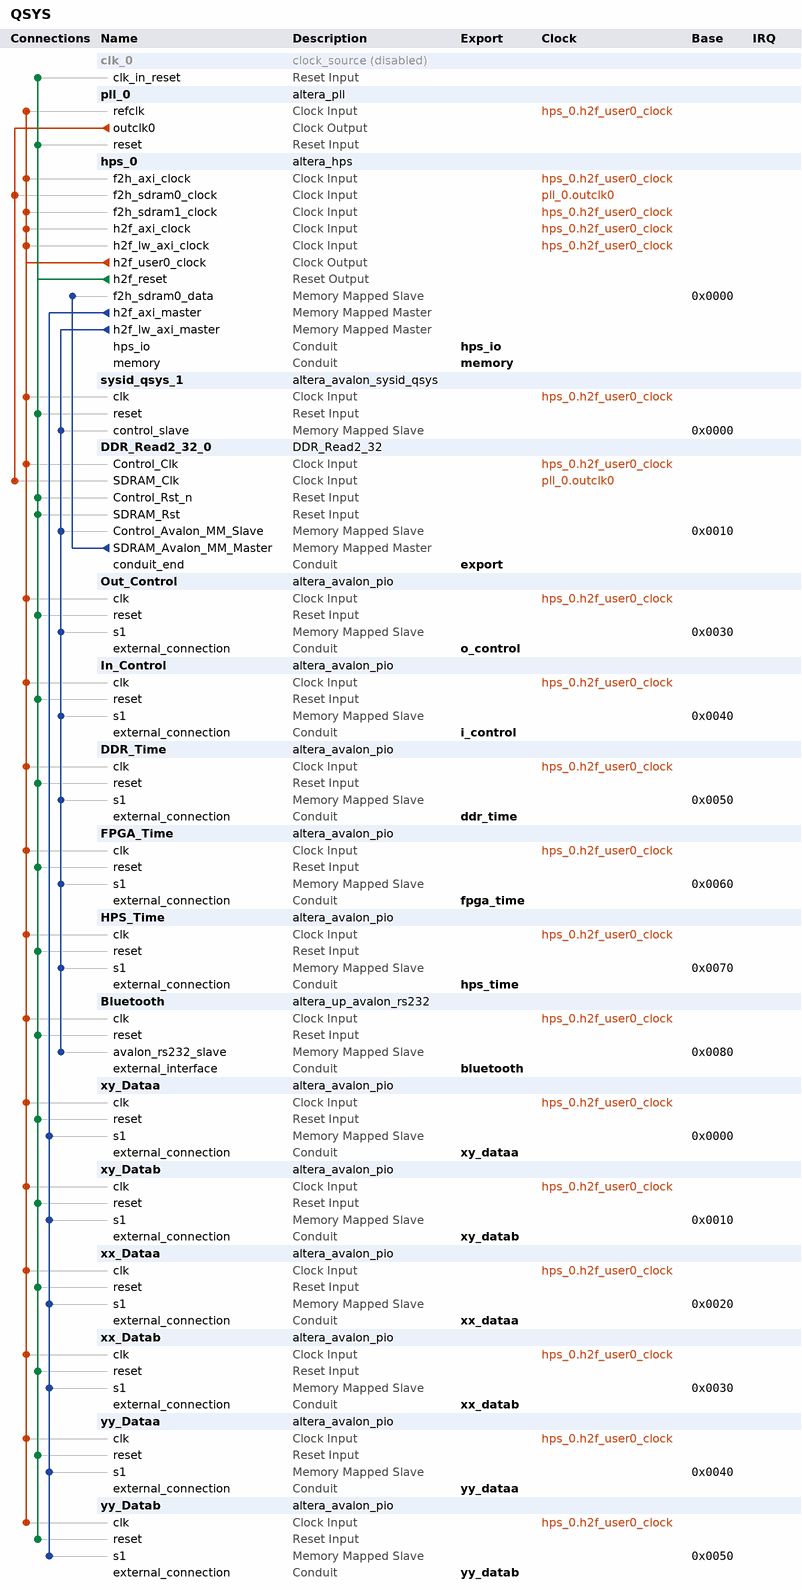
[diagram p0: system contents]
# Platform Designer (Qsys) system QSYS, Cyclone V 5CSXFC6D6F31C6
# Parameters at their usual value, and those the tool derives, are not listed.
package require -exact qsys 20.1
create_system QSYS
set_project_property DEVICE_FAMILY {Cyclone V}
set_project_property DEVICE 5CSXFC6D6F31C6

add_instance clk_0 clock_source 20.1
set_instance_property clk_0 ENABLED false
set_instance_parameter_value clk_0 clockFrequency 100000000

add_instance pll_0 altera_pll 20.1
set_instance_parameter_value pll_0 gui_device_speed_grade 1
set_instance_parameter_value pll_0 gui_number_of_clocks 1
set_instance_parameter_value pll_0 gui_operation_mode direct
set_instance_parameter_value pll_0 gui_output_clock_frequency0 230.0
set_instance_parameter_value pll_0 gui_pll_mode {Integer-N PLL}
set_instance_parameter_value pll_0 gui_reference_clock_frequency 100.0
set_instance_parameter_value pll_0 gui_use_locked true

add_instance hps_0 altera_hps 20.1
set_instance_parameter_value hps_0 CAN0_Mode CAN
set_instance_parameter_value hps_0 CAN0_PinMuxing {HPS I/O Set 1}
set_instance_parameter_value hps_0 EMAC1_Mode RGMII
set_instance_parameter_value hps_0 EMAC1_PinMuxing {HPS I/O Set 0}
set_instance_parameter_value hps_0 F2SCLK_COLDRST_Enable false
set_instance_parameter_value hps_0 F2SCLK_DBGRST_Enable false
set_instance_parameter_value hps_0 F2SCLK_WARMRST_Enable false
set_instance_parameter_value hps_0 F2SDRAM_Type {Avalon-MM Read-Only,Avalon-MM Read-Only}
set_instance_parameter_value hps_0 F2SDRAM_Width 32,32
set_instance_parameter_value hps_0 F2SINTERRUPT_Enable false
set_instance_parameter_value hps_0 F2S_Width 3
set_instance_parameter_value hps_0 FPGA_PERIPHERAL_OUTPUT_CLOCK_FREQ_EMAC0_GTX_CLK 125
set_instance_parameter_value hps_0 FPGA_PERIPHERAL_OUTPUT_CLOCK_FREQ_EMAC0_MD_CLK 2.5
set_instance_parameter_value hps_0 FPGA_PERIPHERAL_OUTPUT_CLOCK_FREQ_EMAC1_GTX_CLK 125
set_instance_parameter_value hps_0 FPGA_PERIPHERAL_OUTPUT_CLOCK_FREQ_EMAC1_MD_CLK 2.5
set_instance_parameter_value hps_0 HPS_PROTOCOL DDR3
set_instance_parameter_value hps_0 I2C0_Mode I2C
set_instance_parameter_value hps_0 I2C0_PinMuxing {HPS I/O Set 1}
set_instance_parameter_value hps_0 I2C1_Mode N/A
set_instance_parameter_value hps_0 I2C1_PinMuxing Unused
set_instance_parameter_value hps_0 LWH2F_Enable true
set_instance_parameter_value hps_0 MEM_BANKADDR_WIDTH 3
set_instance_parameter_value hps_0 MEM_CLK_FREQ 400.0
set_instance_parameter_value hps_0 MEM_COL_ADDR_WIDTH 10
set_instance_parameter_value hps_0 MEM_DQ_WIDTH 32
set_instance_parameter_value hps_0 MEM_DRV_STR RZQ/6
set_instance_parameter_value hps_0 MEM_ROW_ADDR_WIDTH 15
set_instance_parameter_value hps_0 MEM_RTT_NOM RZQ/6
set_instance_parameter_value hps_0 MEM_RTT_WR {Dynamic ODT off}
set_instance_parameter_value hps_0 MEM_TCL 11
set_instance_parameter_value hps_0 MEM_TFAW_NS 45.0
set_instance_parameter_value hps_0 MEM_TRAS_NS 35.0
set_instance_parameter_value hps_0 MEM_TRCD_NS 13.75
set_instance_parameter_value hps_0 MEM_TRFC_NS 260.0
set_instance_parameter_value hps_0 MEM_TRP_NS 13.75
set_instance_parameter_value hps_0 MEM_VENDOR Micron
set_instance_parameter_value hps_0 MEM_WTCL 7
set_instance_parameter_value hps_0 QSPI_Mode N/A
set_instance_parameter_value hps_0 QSPI_PinMuxing Unused
set_instance_parameter_value hps_0 REF_CLK_FREQ 25.0
set_instance_parameter_value hps_0 S2FCLK_USER0CLK_Enable true
set_instance_parameter_value hps_0 S2FCLK_USER2CLK 3
set_instance_parameter_value hps_0 S2F_Width 3
set_instance_parameter_value hps_0 SDIO_Mode {4-bit Data}
set_instance_parameter_value hps_0 SDIO_PinMuxing {HPS I/O Set 0}
set_instance_parameter_value hps_0 SPIM1_Mode N/A
set_instance_parameter_value hps_0 SPIM1_PinMuxing Unused
set_instance_parameter_value hps_0 STM_Enable false
set_instance_parameter_value hps_0 TIMING_BOARD_AC_SKEW 0.02
set_instance_parameter_value hps_0 TIMING_BOARD_AC_TO_CK_SKEW 0.01
set_instance_parameter_value hps_0 TIMING_BOARD_DQ_TO_DQS_SKEW 0.05
set_instance_parameter_value hps_0 TIMING_BOARD_MAX_CK_DELAY 0.03
set_instance_parameter_value hps_0 TIMING_BOARD_MAX_DQS_DELAY 0.02
set_instance_parameter_value hps_0 TIMING_BOARD_SKEW_BETWEEN_DQS 0.06
set_instance_parameter_value hps_0 TIMING_BOARD_SKEW_CKDQS_DIMM_MAX 0.12
set_instance_parameter_value hps_0 TIMING_BOARD_SKEW_CKDQS_DIMM_MIN 0.06
set_instance_parameter_value hps_0 TIMING_BOARD_SKEW_WITHIN_DQS 0.01
set_instance_parameter_value hps_0 TIMING_TDH 65
set_instance_parameter_value hps_0 TIMING_TDQSCK 255
set_instance_parameter_value hps_0 TIMING_TDQSQ 125
set_instance_parameter_value hps_0 TIMING_TDS 30
set_instance_parameter_value hps_0 TIMING_TIH 140
set_instance_parameter_value hps_0 TIMING_TIS 190
set_instance_parameter_value hps_0 TIMING_TQSH 0.4
set_instance_parameter_value hps_0 UART0_Mode {No Flow Control}
set_instance_parameter_value hps_0 UART0_PinMuxing {HPS I/O Set 0}
set_instance_parameter_value hps_0 USB1_Mode SDR
set_instance_parameter_value hps_0 USB1_PinMuxing {HPS I/O Set 0}
set_instance_parameter_value hps_0 desired_cfg_clk_mhz 100.0
set_instance_parameter_value hps_0 desired_qspi_clk_mhz 400.0

add_instance sysid_qsys_1 altera_avalon_sysid_qsys 20.1
set_instance_parameter_value sysid_qsys_1 id 305419896

add_instance DDR_Read2_32_0 DDR_Read2_32 1.0
set_instance_parameter_value DDR_Read2_32_0 MASTER_ADDRESSWIDTH 32
set_instance_parameter_value DDR_Read2_32_0 MASTER_DATAWIDTH 32
set_instance_parameter_value DDR_Read2_32_0 NUMREGS 3
set_instance_parameter_value DDR_Read2_32_0 REGWIDTH 32
set_instance_parameter_value DDR_Read2_32_0 SLAVE_ADDRESSWIDTH 2
set_instance_parameter_value DDR_Read2_32_0 SLAVE_DATAWIDTH 32

add_instance Out_Control altera_avalon_pio 20.1
set_instance_parameter_value Out_Control direction Output
set_instance_parameter_value Out_Control width 32

add_instance In_Control altera_avalon_pio 20.1
set_instance_parameter_value In_Control direction Input
set_instance_parameter_value In_Control width 32

add_instance DDR_Time altera_avalon_pio 20.1
set_instance_parameter_value DDR_Time direction Input
set_instance_parameter_value DDR_Time width 26

add_instance FPGA_Time altera_avalon_pio 20.1
set_instance_parameter_value FPGA_Time direction Input
set_instance_parameter_value FPGA_Time width 26

add_instance HPS_Time altera_avalon_pio 20.1
set_instance_parameter_value HPS_Time direction Input
set_instance_parameter_value HPS_Time width 26

add_instance Bluetooth altera_up_avalon_rs232 17.1
set_instance_parameter_value Bluetooth baud 9600
set_instance_parameter_value Bluetooth parity None

add_instance xy_Dataa altera_avalon_pio 20.1
set_instance_parameter_value xy_Dataa direction Input
set_instance_parameter_value xy_Dataa width 32

add_instance xy_Datab altera_avalon_pio 20.1
set_instance_parameter_value xy_Datab direction Input
set_instance_parameter_value xy_Datab width 32

add_instance xx_Dataa altera_avalon_pio 20.1
set_instance_parameter_value xx_Dataa direction Input
set_instance_parameter_value xx_Dataa width 32

add_instance xx_Datab altera_avalon_pio 20.1
set_instance_parameter_value xx_Datab direction Input
set_instance_parameter_value xx_Datab width 32

add_instance yy_Dataa altera_avalon_pio 20.1
set_instance_parameter_value yy_Dataa direction Input
set_instance_parameter_value yy_Dataa width 32

add_instance yy_Datab altera_avalon_pio 20.1
set_instance_parameter_value yy_Datab direction Input
set_instance_parameter_value yy_Datab width 32

# connections
add_connection hps_0.h2f_user0_clock Bluetooth.clk clock
add_connection hps_0.h2f_user0_clock DDR_Read2_32_0.Control_Clk clock
add_connection hps_0.h2f_user0_clock DDR_Time.clk clock
add_connection hps_0.h2f_user0_clock FPGA_Time.clk clock
add_connection hps_0.h2f_user0_clock hps_0.f2h_axi_clock clock
add_connection hps_0.h2f_user0_clock hps_0.f2h_sdram1_clock clock
add_connection hps_0.h2f_user0_clock hps_0.h2f_axi_clock clock
add_connection hps_0.h2f_user0_clock hps_0.h2f_lw_axi_clock clock
add_connection hps_0.h2f_user0_clock HPS_Time.clk clock
add_connection hps_0.h2f_user0_clock In_Control.clk clock
add_connection hps_0.h2f_user0_clock Out_Control.clk clock
add_connection hps_0.h2f_user0_clock pll_0.refclk clock
add_connection hps_0.h2f_user0_clock sysid_qsys_1.clk clock
add_connection hps_0.h2f_user0_clock xx_Dataa.clk clock
add_connection hps_0.h2f_user0_clock xx_Datab.clk clock
add_connection hps_0.h2f_user0_clock xy_Dataa.clk clock
add_connection hps_0.h2f_user0_clock xy_Datab.clk clock
add_connection hps_0.h2f_user0_clock yy_Dataa.clk clock
add_connection hps_0.h2f_user0_clock yy_Datab.clk clock
add_connection pll_0.outclk0 DDR_Read2_32_0.SDRAM_Clk clock
add_connection pll_0.outclk0 hps_0.f2h_sdram0_clock clock
add_connection hps_0.h2f_reset Bluetooth.reset reset
add_connection hps_0.h2f_reset clk_0.clk_in_reset reset
add_connection hps_0.h2f_reset DDR_Read2_32_0.Control_Rst_n reset
add_connection hps_0.h2f_reset DDR_Read2_32_0.SDRAM_Rst reset
add_connection hps_0.h2f_reset DDR_Time.reset reset
add_connection hps_0.h2f_reset FPGA_Time.reset reset
add_connection hps_0.h2f_reset HPS_Time.reset reset
add_connection hps_0.h2f_reset In_Control.reset reset
add_connection hps_0.h2f_reset Out_Control.reset reset
add_connection hps_0.h2f_reset pll_0.reset reset
add_connection hps_0.h2f_reset sysid_qsys_1.reset reset
add_connection hps_0.h2f_reset xx_Dataa.reset reset
add_connection hps_0.h2f_reset xx_Datab.reset reset
add_connection hps_0.h2f_reset xy_Dataa.reset reset
add_connection hps_0.h2f_reset xy_Datab.reset reset
add_connection hps_0.h2f_reset yy_Dataa.reset reset
add_connection hps_0.h2f_reset yy_Datab.reset reset
add_connection DDR_Read2_32_0.SDRAM_Avalon_MM_Master hps_0.f2h_sdram0_data avalon
set_connection_parameter_value DDR_Read2_32_0.SDRAM_Avalon_MM_Master/hps_0.f2h_sdram0_data baseAddress 0x0000
add_connection hps_0.h2f_axi_master xx_Dataa.s1 avalon
set_connection_parameter_value hps_0.h2f_axi_master/xx_Dataa.s1 baseAddress 0x0020
add_connection hps_0.h2f_axi_master xx_Datab.s1 avalon
set_connection_parameter_value hps_0.h2f_axi_master/xx_Datab.s1 baseAddress 0x0030
add_connection hps_0.h2f_axi_master xy_Dataa.s1 avalon
set_connection_parameter_value hps_0.h2f_axi_master/xy_Dataa.s1 baseAddress 0x0000
add_connection hps_0.h2f_axi_master xy_Datab.s1 avalon
set_connection_parameter_value hps_0.h2f_axi_master/xy_Datab.s1 baseAddress 0x0010
add_connection hps_0.h2f_axi_master yy_Dataa.s1 avalon
set_connection_parameter_value hps_0.h2f_axi_master/yy_Dataa.s1 baseAddress 0x0040
add_connection hps_0.h2f_axi_master yy_Datab.s1 avalon
set_connection_parameter_value hps_0.h2f_axi_master/yy_Datab.s1 baseAddress 0x0050
add_connection hps_0.h2f_lw_axi_master Bluetooth.avalon_rs232_slave avalon
set_connection_parameter_value hps_0.h2f_lw_axi_master/Bluetooth.avalon_rs232_slave baseAddress 0x0080
add_connection hps_0.h2f_lw_axi_master DDR_Read2_32_0.Control_Avalon_MM_Slave avalon
set_connection_parameter_value hps_0.h2f_lw_axi_master/DDR_Read2_32_0.Control_Avalon_MM_Slave baseAddress 0x0010
add_connection hps_0.h2f_lw_axi_master DDR_Time.s1 avalon
set_connection_parameter_value hps_0.h2f_lw_axi_master/DDR_Time.s1 baseAddress 0x0050
add_connection hps_0.h2f_lw_axi_master FPGA_Time.s1 avalon
set_connection_parameter_value hps_0.h2f_lw_axi_master/FPGA_Time.s1 baseAddress 0x0060
add_connection hps_0.h2f_lw_axi_master HPS_Time.s1 avalon
set_connection_parameter_value hps_0.h2f_lw_axi_master/HPS_Time.s1 baseAddress 0x0070
add_connection hps_0.h2f_lw_axi_master In_Control.s1 avalon
set_connection_parameter_value hps_0.h2f_lw_axi_master/In_Control.s1 baseAddress 0x0040
add_connection hps_0.h2f_lw_axi_master Out_Control.s1 avalon
set_connection_parameter_value hps_0.h2f_lw_axi_master/Out_Control.s1 baseAddress 0x0030
add_connection hps_0.h2f_lw_axi_master sysid_qsys_1.control_slave avalon
set_connection_parameter_value hps_0.h2f_lw_axi_master/sysid_qsys_1.control_slave baseAddress 0x0000

# exported interfaces
add_interface bluetooth conduit end
set_interface_property bluetooth EXPORT_OF Bluetooth.external_interface
add_interface ddr_time conduit end
set_interface_property ddr_time EXPORT_OF DDR_Time.external_connection
add_interface export conduit end
set_interface_property export EXPORT_OF DDR_Read2_32_0.conduit_end
add_interface fpga_time conduit end
set_interface_property fpga_time EXPORT_OF FPGA_Time.external_connection
add_interface hps_io conduit end
set_interface_property hps_io EXPORT_OF hps_0.hps_io
add_interface hps_time conduit end
set_interface_property hps_time EXPORT_OF HPS_Time.external_connection
add_interface i_control conduit end
set_interface_property i_control EXPORT_OF In_Control.external_connection
add_interface memory conduit end
set_interface_property memory EXPORT_OF hps_0.memory
add_interface o_control conduit end
set_interface_property o_control EXPORT_OF Out_Control.external_connection
add_interface xx_dataa conduit end
set_interface_property xx_dataa EXPORT_OF xx_Dataa.external_connection
add_interface xx_datab conduit end
set_interface_property xx_datab EXPORT_OF xx_Datab.external_connection
add_interface xy_dataa conduit end
set_interface_property xy_dataa EXPORT_OF xy_Dataa.external_connection
add_interface xy_datab conduit end
set_interface_property xy_datab EXPORT_OF xy_Datab.external_connection
add_interface yy_dataa conduit end
set_interface_property yy_dataa EXPORT_OF yy_Dataa.external_connection
add_interface yy_datab conduit end
set_interface_property yy_datab EXPORT_OF yy_Datab.external_connection

set_interconnect_requirement {$system} qsys_mm.clockCrossingAdapter HANDSHAKE
set_interconnect_requirement {$system} qsys_mm.enableEccProtection FALSE
set_interconnect_requirement {$system} qsys_mm.insertDefaultSlave FALSE
set_interconnect_requirement {$system} qsys_mm.maxAdditionalLatency 1

save_system QSYS.qsys
